# Altium schematic sheet FPGA.SchDoc
size A3
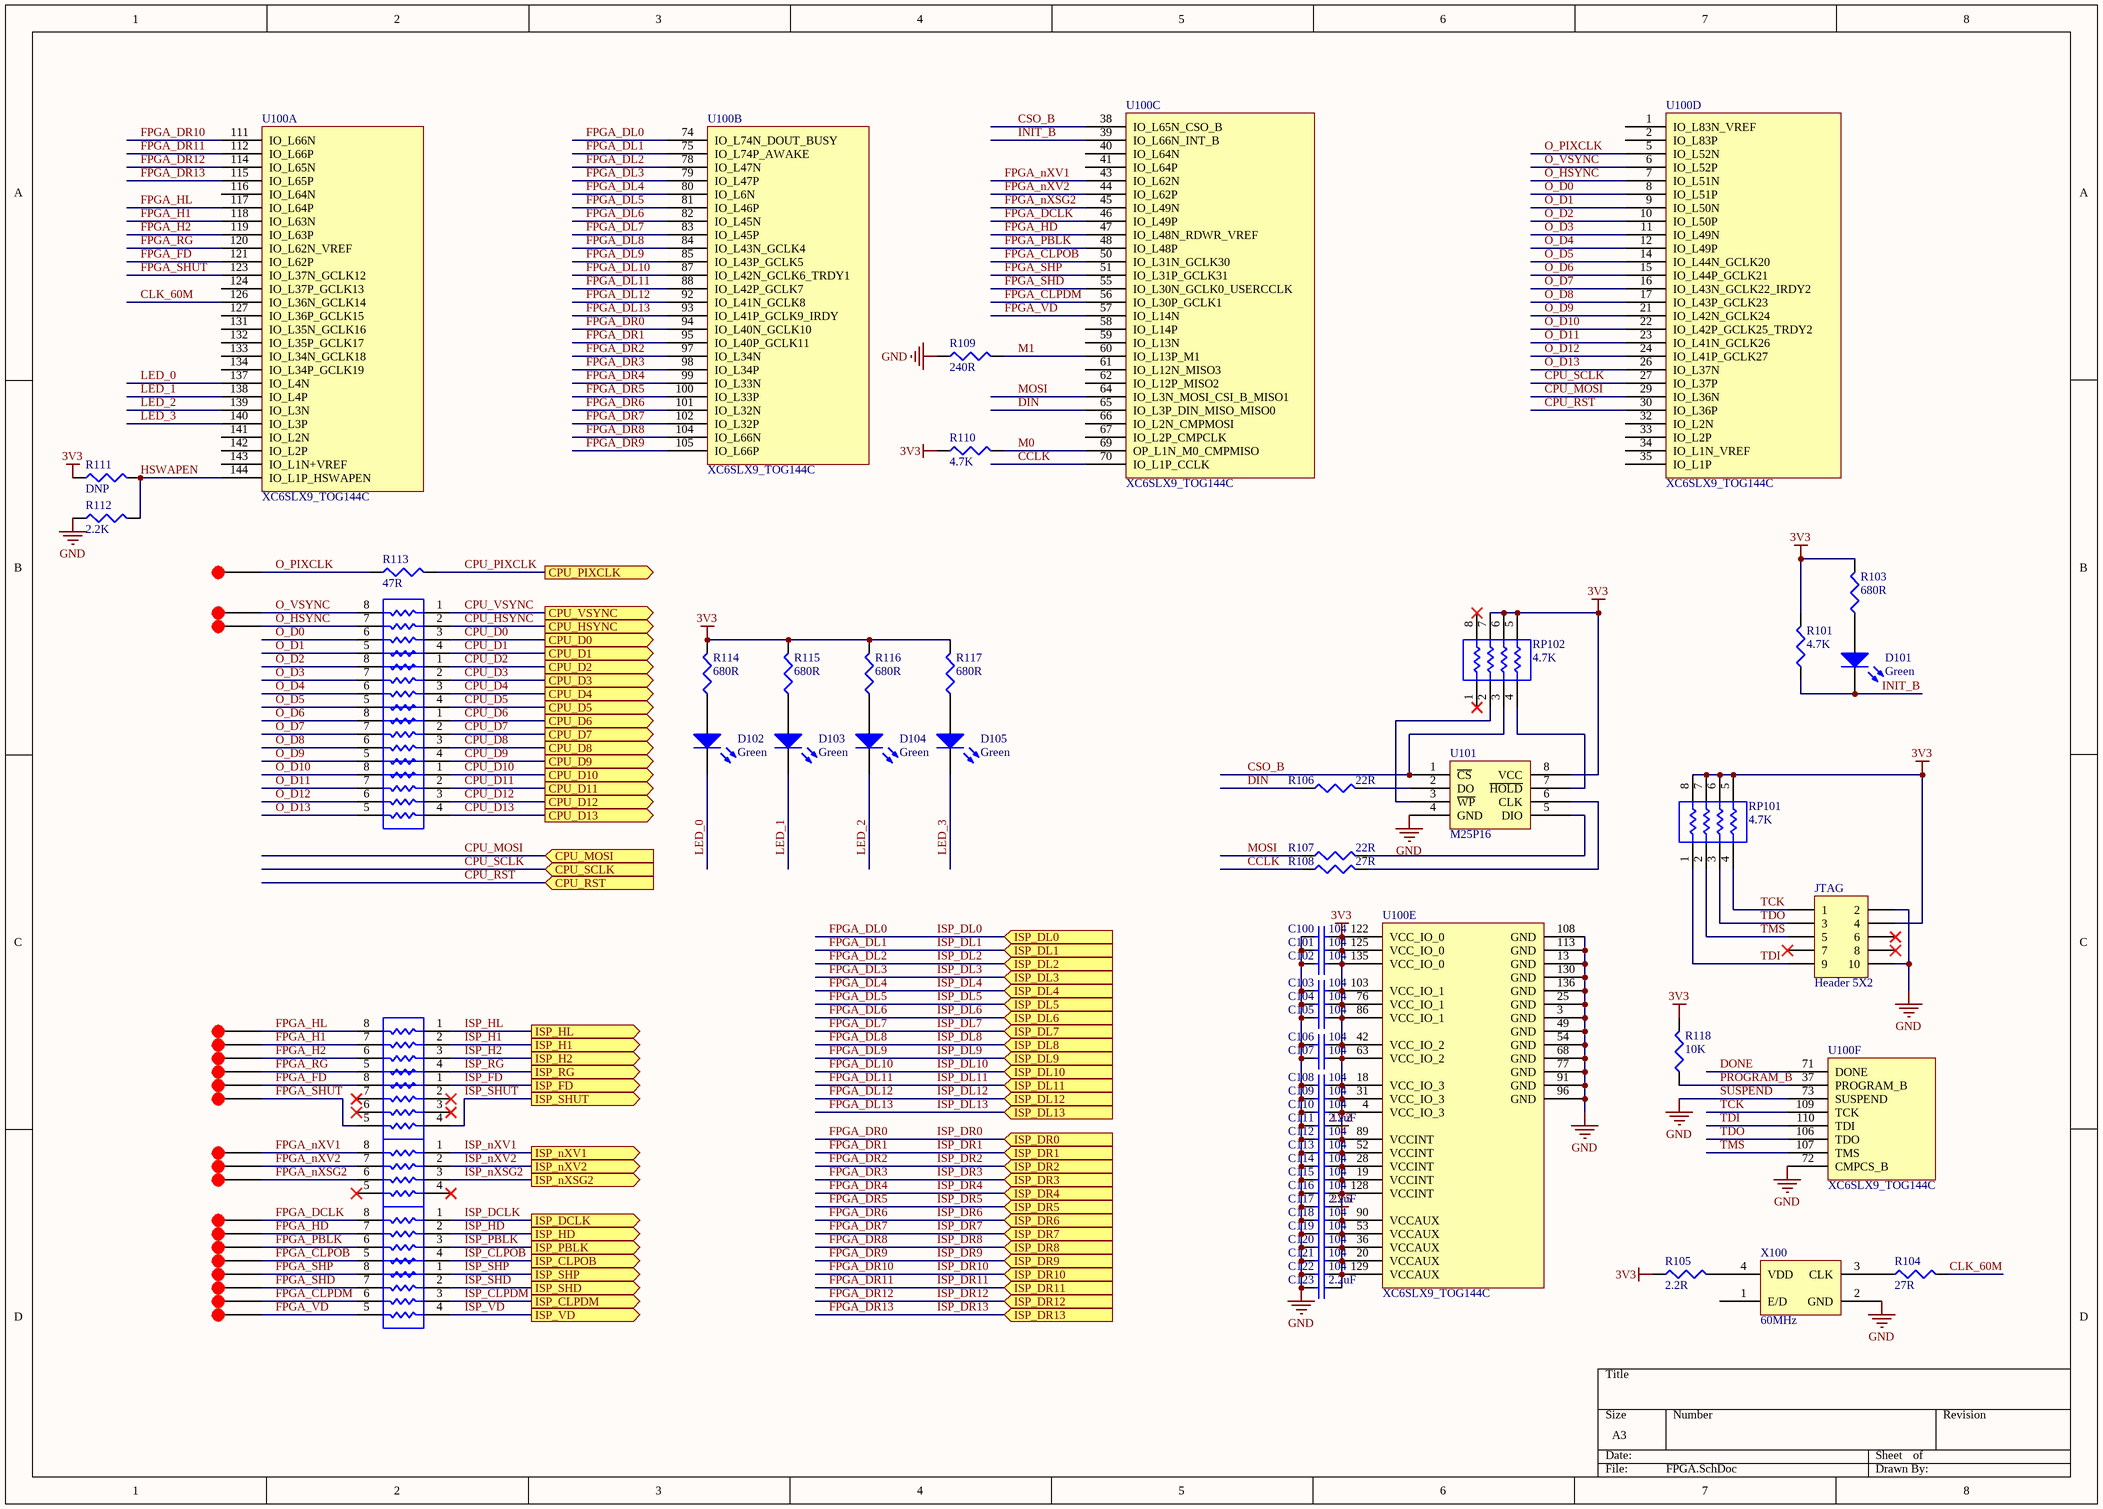
[diagram p0: FPGA.SchDoc]

## Parts
C100  104  [C0402]
C101  104  [C0402]
C102  104  [C0402]
C103  104  [C0402]
C104  104  [C0402]
C105  104  [C0402]
C106  104  [C0402]
C107  104  [C0402]
C108  104  [C0402]
C109  104  [C0402]
C110  104  [C0402]
C111  2.2uF  [C0603]
C112  104  [C0402]
C113  104  [C0402]
C114  104  [C0402]
C115  104  [C0402]
C116  104  [C0402]
C117  2.2uF  [C0603]
C118  104  [C0402]
C119  104  [C0402]
C120  104  [C0402]
C121  104  [C0402]
C122  104  [C0402]
C123  2.2uF  [C0603]
D101  Green  [D0805]
D102  Green  [D0805]
D103  Green  [D0805]
D104  Green  [D0805]
D105  Green  [D0805]
JTAG  Header 5X2  [HEADER10]
R101  4.7K  [R0603]
R103  680R  [R0603]
R104  27R  [R0603]
R105  2.2R  [R0603]
R106  22R  [R0603]
R107  22R  [R0603]
R108  27R  [R0603]
R109  240R  [R0603]
R110  4.7K  [R0603]
R111  DNP  [R0603]
R112  2.2K  [R0603]
R113  47R  [R0603]
R114  680R  [R0603]
R115  680R  [R0603]
R116  680R  [R0603]
R117  680R  [R0603]
R118  10K  [R0603]
RP101  4.7K  [R0402S4]
RP102  4.7K  [R0402S4]
RP103  22R  [R0402S4]  (value not drawn)
RP104  22R  [R0402S4]  (value not drawn)
RP105  22R  [R0402S4]  (value not drawn)
RP106  22R  [R0402S4]  (value not drawn)
RP107  22R  [R0402S4]  (value not drawn)
RP108  22R  [R0402S4]  (value not drawn)
RP109  22R  [R0402S4]  (value not drawn)
RP110  22R  [R0402S4]  (value not drawn)
RP111  22R  [R0402S4]  (value not drawn)
TP0  TestPoint  [T_0_7]  (value not drawn)
TP1  TestPoint  [T_0_7]  (value not drawn)
TP2  TestPoint  [T_0_7]  (value not drawn)
TP3  TestPoint  [T_0_7]  (value not drawn)
TP4  TestPoint  [T_0_7]  (value not drawn)
TP5  TestPoint  [T_0_7]  (value not drawn)
TP6  TestPoint  [T_0_7]  (value not drawn)
TP7  TestPoint  [T_0_7]  (value not drawn)
TP8  TestPoint  [T_0_7]  (value not drawn)
TP9  TestPoint  [T_0_7]  (value not drawn)
TP10  TestPoint  [T_0_7]  (value not drawn)
TP11  TestPoint  [T_0_7]  (value not drawn)
TP12  TestPoint  [T_0_7]  (value not drawn)
TP13  TestPoint  [T_0_7]  (value not drawn)
TP14  TestPoint  [T_0_7]  (value not drawn)
TP15  TestPoint  [T_0_7]  (value not drawn)
TP16  TestPoint  [T_0_7]  (value not drawn)
TP17  TestPoint  [T_0_7]  (value not drawn)
TP18  TestPoint  [T_0_7]  (value not drawn)
TP19  TestPoint  [T_0_7]  (value not drawn)
U100  XC6SLX9_TOG144C  [TQFP144]  (parts A,B,C,D,E,F of 6)
U101  M25P16  [SOP-8]
X100  60MHz  [CRY_D3225]

## Ports
CPU_D0 (out), CPU_D1 (out), CPU_D2 (out), CPU_D3 (out), CPU_D4 (out), CPU_D5 (out), CPU_D6 (out), CPU_D7 (out), CPU_D8 (out), CPU_D9 (out), CPU_D10 (out), CPU_D11 (out), CPU_D12 (out), CPU_D13 (out), CPU_HSYNC (out), CPU_MOSI (in), CPU_PIXCLK (out), CPU_RST (in), CPU_SCLK (in), CPU_VSYNC (out), ISP_CLPDM (out), ISP_CLPOB (out), ISP_DCLK (out), ISP_DL0 (in), ISP_DL1 (in), ISP_DL2 (in), ISP_DL3 (in), ISP_DL4 (in), ISP_DL5 (in), ISP_DL6 (in), ISP_DL7 (in), ISP_DL8 (in), ISP_DL9 (in), ISP_DL10 (in), ISP_DL11 (in), ISP_DL12 (in), ISP_DL13 (in), ISP_DR0 (in), ISP_DR1 (in), ISP_DR2 (in), ISP_DR3 (in), ISP_DR4 (in), ISP_DR5 (in), ISP_DR6 (in), ISP_DR7 (in), ISP_DR8 (in), ISP_DR9 (in), ISP_DR10 (in), ISP_DR11 (in), ISP_DR12 (in), ISP_DR13 (in), ISP_FD (out), ISP_H1 (out), ISP_H2 (out), ISP_HD (out), ISP_HL (out), ISP_nXSG2 (out), ISP_nXV1 (out), ISP_nXV2 (out), ISP_PBLK (out), ISP_RG (out), ISP_SHD (out), ISP_SHP (out), ISP_SHUT (out), ISP_VD (out)

## Nets
1V2: C112.2 C113.2 C114.2 C115.2 C116.2 C117.2 U100.19(VCCINT) U100.28(VCCINT) U100.52(VCCINT) U100.89(VCCINT) U100.128(VCCINT)
2V5: C118.2 C119.2 C120.2 C121.2 C122.2 C123.2 U100.20(VCCAUX) U100.36(VCCAUX) U100.53(VCCAUX) U100.90(VCCAUX) U100.129(VCCAUX)
3V3: C100.2 C101.2 C102.2 C103.2 C104.2 C105.2 C106.2 C107.2 C108.2 C109.2 C110.2 C111.2 JTAG.4 R101.2 R103.2 R105.1 R110.1 R111.1 R114.2 R115.2 R116.2 R117.2 R118.2 RP101.5 RP101.6 RP101.7 RP101.8 RP102.5 RP102.6 RP102.7 U100.4(VCC_IO_3) U100.18(VCC_IO_3) U100.31(VCC_IO_3) U100.42(VCC_IO_2) U100.63(VCC_IO_2) U100.76(VCC_IO_1) U100.86(VCC_IO_1) U100.103(VCC_IO_1) U100.122(VCC_IO_0) U100.125(VCC_IO_0) U100.135(VCC_IO_0) U101.8(VCC)
SUSPEND: C100.1 C101.1 C102.1 C103.1 C104.1 C105.1 C106.1 C107.1 C108.1 C109.1 C110.1 C111.1 C112.1 C113.1 C114.1 C115.1 C116.1 C117.1 C118.1 C119.1 C120.1 C121.1 C122.1 C123.1 JTAG.2 JTAG.10 R109.1 R112.1 U100.3(GND) U100.13(GND) U100.25(GND) U100.49(GND) U100.54(GND) U100.68(GND) U100.72(CMPCS_B) U100.73(SUSPEND) U100.77(GND) U100.91(GND) U100.96(GND) U100.108(GND) U100.113(GND) U100.130(GND) U100.136(GND) U101.4(GND) X100.2(GND)  [also labelled GND]
CCLK: R108.1 U100.70(IO_L1P_CCLK)
CLK_60M: R104.2 U100.126(IO_L36N_GCLK14)
CPU_D0: RP108.3 ; port CPU_D0
CPU_D1: RP108.4 ; port CPU_D1
CPU_D2: RP109.1 ; port CPU_D2
CPU_D3: RP109.2 ; port CPU_D3
CPU_D4: RP109.3 ; port CPU_D4
CPU_D5: RP109.4 ; port CPU_D5
CPU_D6: RP110.1 ; port CPU_D6
CPU_D7: RP110.2 ; port CPU_D7
CPU_D8: RP110.3 ; port CPU_D8
CPU_D9: RP110.4 ; port CPU_D9
CPU_D10: RP111.1 ; port CPU_D10
CPU_D11: RP111.2 ; port CPU_D11
CPU_D12: RP111.3 ; port CPU_D12
CPU_D13: RP111.4 ; port CPU_D13
CPU_HSYNC: RP108.2 ; port CPU_HSYNC
CPU_MOSI: U100.29(IO_L36N) ; port CPU_MOSI
CPU_PIXCLK: R113.2 ; port CPU_PIXCLK
CPU_RST: U100.30(IO_L36P) ; port CPU_RST
CPU_SCLK: U100.27(IO_L37P) ; port CPU_SCLK
CPU_VSYNC: RP108.1 ; port CPU_VSYNC
CSO_B: RP102.3 U100.38(IO_L65N_CSO_B) U101.1(~{CS})
DIN: R106.1 U100.65(IO_L3P_DIN_MISO_MISO0)
DONE: U100.71(DONE)
FPGA_CLPDM: RP106.6 TP15.1(CMPCS_B) U100.56(IO_L30P_GCLK1)
FPGA_CLPOB: RP105.5 TP12.1(CMPCS_B) U100.50(IO_L31N_GCLK30)
FPGA_DCLK: RP105.8 TP9.1(CMPCS_B) U100.46(IO_L49P)
FPGA_DL0: U100.74(IO_L74N_DOUT_BUSY) ; port ISP_DL0  [also labelled ISP_DL0]
FPGA_DL1: U100.75(IO_L74P_AWAKE) ; port ISP_DL1  [also labelled ISP_DL1]
FPGA_DL2: U100.78(IO_L47N) ; port ISP_DL2  [also labelled ISP_DL2]
FPGA_DL3: U100.79(IO_L47P) ; port ISP_DL3  [also labelled ISP_DL3]
FPGA_DL4: U100.80(IO_L6N) ; port ISP_DL4  [also labelled ISP_DL4]
FPGA_DL5: U100.81(IO_L46P) ; port ISP_DL5  [also labelled ISP_DL5]
FPGA_DL6: U100.82(IO_L45N) ; port ISP_DL6  [also labelled ISP_DL6]
FPGA_DL7: U100.83(IO_L45P) ; port ISP_DL7  [also labelled ISP_DL7]
FPGA_DL8: U100.84(IO_L43N_GCLK4) ; port ISP_DL8  [also labelled ISP_DL8]
FPGA_DL9: U100.85(IO_L43P_GCLK5) ; port ISP_DL9  [also labelled ISP_DL9]
FPGA_DL10: U100.87(IO_L42N_GCLK6_TRDY1) ; port ISP_DL10  [also labelled ISP_DL10]
FPGA_DL11: U100.88(IO_L42P_GCLK7) ; port ISP_DL11  [also labelled ISP_DL11]
FPGA_DL12: U100.92(IO_L41N_GCLK8) ; port ISP_DL12  [also labelled ISP_DL12]
FPGA_DL13: U100.93(IO_L41P_GCLK9_IRDY) ; port ISP_DL13  [also labelled ISP_DL13]
FPGA_DR0: U100.94(IO_L40N_GCLK10) ; port ISP_DR0  [also labelled ISP_DR0]
FPGA_DR1: U100.95(IO_L40P_GCLK11) ; port ISP_DR1  [also labelled ISP_DR1]
FPGA_DR2: U100.97(IO_L34N) ; port ISP_DR2  [also labelled ISP_DR2]
FPGA_DR3: U100.98(IO_L34P) ; port ISP_DR3  [also labelled ISP_DR3]
FPGA_DR4: U100.99(IO_L33N) ; port ISP_DR4  [also labelled ISP_DR4]
FPGA_DR5: U100.100(IO_L33P) ; port ISP_DR5  [also labelled ISP_DR5]
FPGA_DR6: U100.101(IO_L32N) ; port ISP_DR6  [also labelled ISP_DR6]
FPGA_DR7: U100.102(IO_L32P) ; port ISP_DR7  [also labelled ISP_DR7]
FPGA_DR8: U100.104(IO_L66N) ; port ISP_DR8  [also labelled ISP_DR8]
FPGA_DR9: U100.105(IO_L66P) ; port ISP_DR9  [also labelled ISP_DR9]
FPGA_DR10: U100.111(IO_L66N) ; port ISP_DR10  [also labelled ISP_DR10]
FPGA_DR11: U100.112(IO_L66P) ; port ISP_DR11  [also labelled ISP_DR11]
FPGA_DR12: U100.114(IO_L65N) ; port ISP_DR12  [also labelled ISP_DR12]
FPGA_DR13: U100.115(IO_L65P) ; port ISP_DR13  [also labelled ISP_DR13]
FPGA_FD: RP107.8 TP4.1(CMPCS_B) U100.121(IO_L62P)
FPGA_H1: RP103.7 TP1.1(CMPCS_B) U100.118(IO_L63N)
FPGA_H2: RP103.6 TP2.1(CMPCS_B) U100.119(IO_L63P)
FPGA_HD: RP105.7 TP10.1(CMPCS_B) U100.47(IO_L48N_RDWR_VREF)
FPGA_HL: RP103.8 TP0.1(CMPCS_B) U100.117(IO_L64P)
FPGA_nXSG2: RP104.6 TP8.1(CMPCS_B) U100.45(IO_L49N)
FPGA_nXV1: RP104.8 TP6.1(CMPCS_B) U100.43(IO_L62N)
FPGA_nXV2: RP104.7 TP7.1(CMPCS_B) U100.44(IO_L62P)
FPGA_PBLK: RP105.6 TP11.1(CMPCS_B) U100.48(IO_L48P)
FPGA_RG: RP103.5 TP3.1(CMPCS_B) U100.120(IO_L62N_VREF)
FPGA_SHD: RP106.7 TP14.1(CMPCS_B) U100.55(IO_L30N_GCLK0_USERCCLK)
FPGA_SHP: RP106.8 TP13.1(CMPCS_B) U100.51(IO_L31P_GCLK31)
FPGA_SHUT: RP107.5 TP5.1(CMPCS_B) U100.123(IO_L37N_GCLK12)
FPGA_VD: RP106.5 TP16.1(CMPCS_B) U100.57(IO_L14N)
HSWAPEN: R111.2 R112.2 U100.144(IO_L1P_HSWAPEN)
INIT_B: D101.2(K) R101.1 U100.39(IO_L66N_INT_B)
ISP_CLPDM: RP106.3 ; port ISP_CLPDM
ISP_CLPOB: RP105.4 ; port ISP_CLPOB
ISP_DCLK: RP105.1 ; port ISP_DCLK
ISP_FD: RP107.1 ; port ISP_FD
ISP_H1: RP103.2 ; port ISP_H1
ISP_H2: RP103.3 ; port ISP_H2
ISP_HD: RP105.2 ; port ISP_HD
ISP_HL: RP103.1 ; port ISP_HL
ISP_nXSG2: RP104.3 ; port ISP_nXSG2
ISP_nXV1: RP104.1 ; port ISP_nXV1
ISP_nXV2: RP104.2 ; port ISP_nXV2
ISP_PBLK: RP105.3 ; port ISP_PBLK
ISP_RG: RP103.4 ; port ISP_RG
ISP_SHD: RP106.2 ; port ISP_SHD
ISP_SHP: RP106.1 ; port ISP_SHP
ISP_SHUT: RP107.4 ; port ISP_SHUT
ISP_VD: RP106.4 ; port ISP_VD
LED_0: D102.2(K) U100.137(IO_L4N)
LED_1: D103.2(K) U100.138(IO_L4P)
LED_2: D104.2(K) U100.139(IO_L3N)
LED_3: D105.2(K) U100.140(IO_L3P)
M0: R110.2 U100.69(OP_L1N_M0_CMPMISO)
M1: R109.2 U100.60(IO_L13P_M1)
MOSI: R107.1 U100.64(IO_L3N_MOSI_CSI_B_MISO1)
O_D0: RP108.6 U100.8(IO_L51P)
O_D1: RP108.5 U100.9(IO_L50N)
O_D2: RP109.8 U100.10(IO_L50P)
O_D3: RP109.7 U100.11(IO_L49N)
O_D4: RP109.6 U100.12(IO_L49P)
O_D5: RP109.5 U100.14(IO_L44N_GCLK20)
O_D6: RP110.8 U100.15(IO_L44P_GCLK21)
O_D7: RP110.7 U100.16(IO_L43N_GCLK22_IRDY2)
O_D8: RP110.6 U100.17(IO_L43P_GCLK23)
O_D9: RP110.5 U100.21(IO_L42N_GCLK24)
O_D10: RP111.8 U100.22(IO_L42P_GCLK25_TRDY2)
O_D11: RP111.7 U100.23(IO_L41N_GCLK26)
O_D12: RP111.6 U100.24(IO_L41P_GCLK27)
O_D13: RP111.5 U100.26(IO_L37N)
O_HSYNC: RP108.7 TP19.1(CMPCS_B) U100.7(IO_L51N)
O_PIXCLK: R113.1 TP17.1(CMPCS_B) U100.5(IO_L52N)
O_VSYNC: RP108.8 TP18.1(CMPCS_B) U100.6(IO_L52P)
PROGRAM_B: R118.1 U100.37(PROGRAM_B)
TCK: JTAG.1 RP101.4 U100.109(TCK)
TDI: JTAG.9 RP101.1 U100.110(TDI)
TDO: JTAG.3 RP101.3 U100.106(TDO)
TMS: JTAG.5 RP101.2 U100.107(TMS)
NetD101_1: D101.1(A) R103.1
NetD102_1: D102.1(A) R114.1
NetD103_1: D103.1(A) R115.1
NetD104_1: D104.1(A) R116.1
NetD105_1: D105.1(A) R117.1
NetR104_1: R104.1 X100.3(CLK)
NetR105_2: R105.2 X100.4(VDD)
NetR106_2: R106.2 U101.2(DO)
NetR107_2: R107.2 U101.5(DIO)
NetR108_2: R108.2 U101.6(CLK)
NetRP102_2: RP102.2 U101.3(~{WP})
NetRP102_4: RP102.4 U101.7(~{HOLD})

Not connected (* = marked no-connect by the designer): JTAG 6* 7* 8*; RP102 1* 8*; RP104 4* 5*; RP107 2* 3* 6* 7*; U100 1(IO_L83N_VREF) 2(IO_L83P) 32(IO_L2N) 33(IO_L2P) 34(IO_L1N_VREF) 35(IO_L1P) 40(IO_L64N) 41(IO_L64P) 58(IO_L14P) 59(IO_L13N) 61(IO_L12N_MISO3) 62(IO_L12P_MISO2) 66(IO_L2N_CMPMOSI) 67(IO_L2P_CMPCLK) 116(IO_L64N) 124(IO_L37P_GCLK13) 127(IO_L36P_GCLK15) 131(IO_L35N_GCLK16) 132(IO_L35P_GCLK17) 133(IO_L34N_GCLK18) 134(IO_L34P_GCLK19) 141(IO_L2N) 142(IO_L2P) 143(IO_L1N+VREF); X100 1(E/D)

## Library data of the parts
C100-C123 = Cap Semi: Capacitor (Semiconductor SIM Model); Value: 100pF; Published: 8-Jun-2000; LatestRevisionDate: 29-May-2009; LatestRevisionNote: IPC-7351 Footprint Added.; PackageReference: C1206; Publisher: Altium Limited; PackageDescription: Chip Capacitor
D101-D105 = SMDLED: Typical RED, GREEN, YELLOW, AMBER GaAs LED; Published: 8-Jun-2000; LatestRevisionDate: 17-Jul-2002; LatestRevisionNote: Re-released for DXP Platform.; PackageVersion: Feb-2002; PackageReference: 3.2X1.6X1.1; Publisher: Altium Limited; PackageDescription: SM LED; 2 Flat Leads
JTAG = Header 5X2: Header, 5-Pin, Dual row; LatestRevisionDate: 17-Jul-2002; LatestRevisionNote: Re-released for DXP Platform.; Publisher: Altium Limited
R101 R103-R118 = Res3: Resistor; Value: 1K; Published: 8-Jun-2000; LatestRevisionDate: 29-May-2009; LatestRevisionNote: IPC-7351 Footprint Added.; PackageReference: J1-0603; Publisher: Altium Limited; PackageDescription: Chip Resistor
RP101-RP111 = ResPack: Isolated Resistor Network; Value: 1K; Published: 24-Mar-1999; LatestRevisionDate: 29-May-2009; LatestRevisionNote: IPC-7351 Footprint Added.; PackageReference: SO-16; Publisher: Altium Limited; PackageDescription: 16-Pin Small Outline Integrated Circuit 1.27 mm Pitch; Code_JEDEC: MS-012-AC; Code_IPC: SOIC127P600-16
U101 = W25X16
X100 = XTAL_5X7